# EAGLE design MidiIO (EAGLE 6.5.0)
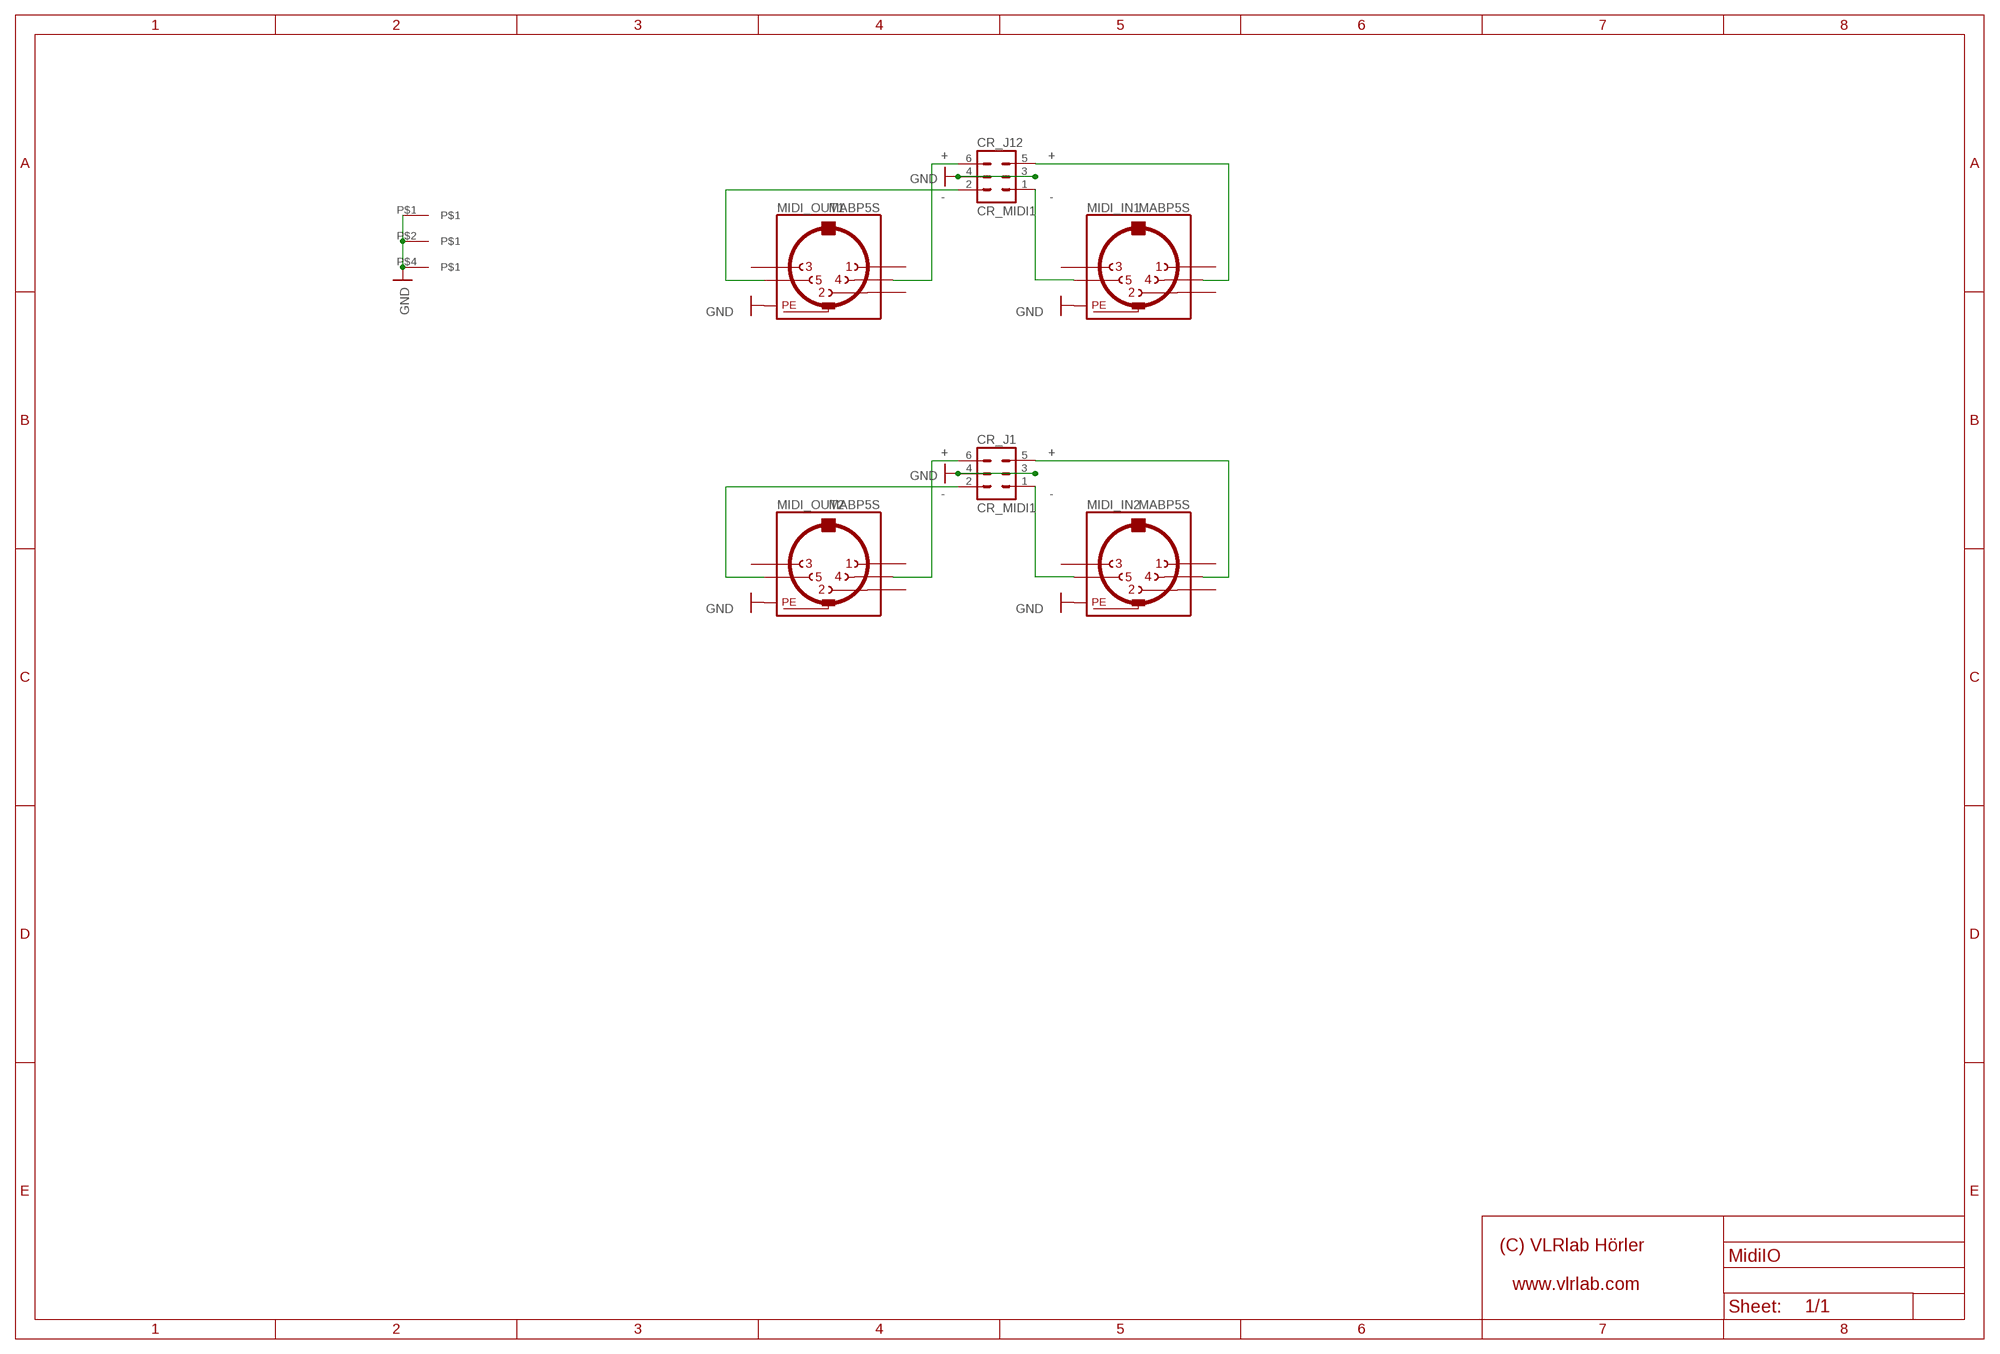
[diagram p0: schematic, sheet 1]

## Parts
CR_J1  CR_MIDI1  ML6  [ML6]
CR_J12  CR_MIDI1  ML6  [ML6]
MIDI_IN1  MABP5S  [MABP5S]
MIDI_IN2  MABP5S  [MABP5S]
MIDI_OUT1  MABP5S  [MABP5S]
MIDI_OUT2  MABP5S  [MABP5S]
U$2  MIDIBOX_HALF_FRONTLINE  [MIDIBOX14X6-FRONTLINE]

## Nets
CR_M1+: CR_J12.5 MIDI_IN1.4
CR_M1+1: CR_J1.5 MIDI_IN2.4
CR_M1-: CR_J12.1 MIDI_IN1.5
CR_M1-1: CR_J1.1 MIDI_IN2.5
GND: CR_J1.3 CR_J1.4 CR_J12.3 CR_J12.4 MIDI_IN1.PE MIDI_IN1.PE@(PE) MIDI_IN2.PE MIDI_IN2.PE@(PE) MIDI_OUT1.PE MIDI_OUT1.PE@(PE) MIDI_OUT2.PE MIDI_OUT2.PE@(PE) U$2.P$1 U$2.P$2 U$2.P$4
N$2: CR_J1.6 MIDI_OUT2.4
N$3: CR_J1.2 MIDI_OUT2.5
N$5: CR_J12.6 MIDI_OUT1.4
N$81: CR_J12.2 MIDI_OUT1.5
Unconnected: MIDI_IN1.1 MIDI_IN1.2 MIDI_IN1.3 MIDI_IN2.1 MIDI_IN2.2 MIDI_IN2.3 MIDI_OUT1.1 MIDI_OUT1.2 MIDI_OUT1.3 MIDI_OUT2.1 MIDI_OUT2.2 MIDI_OUT2.3

## Notes on the sheet
- + | +
- - | -
- + | +
- - | -

## Library data of the parts
CR_J1 CR_J12 = con-harting-ml:ML6: HARTING; OC_FARNELL: unknown; OC_NEWARK: unknown
MIDI_IN1 MIDI_IN2 MIDI_OUT1 MIDI_OUT2 = midi:MABP5S
U$2 = Frames_VLR:MIDIBOX_HALF_FRONTLINE

## Net classes
0 default: width 0.254 mm, drill 0.33 mm, clearance 0.254 mm
1 VDD: width 1.016 mm, drill 0.33 mm, clearance 0.254 mm to class 0, clearance 0.254 mm
3 SDcard: width 0.406 mm

## Board
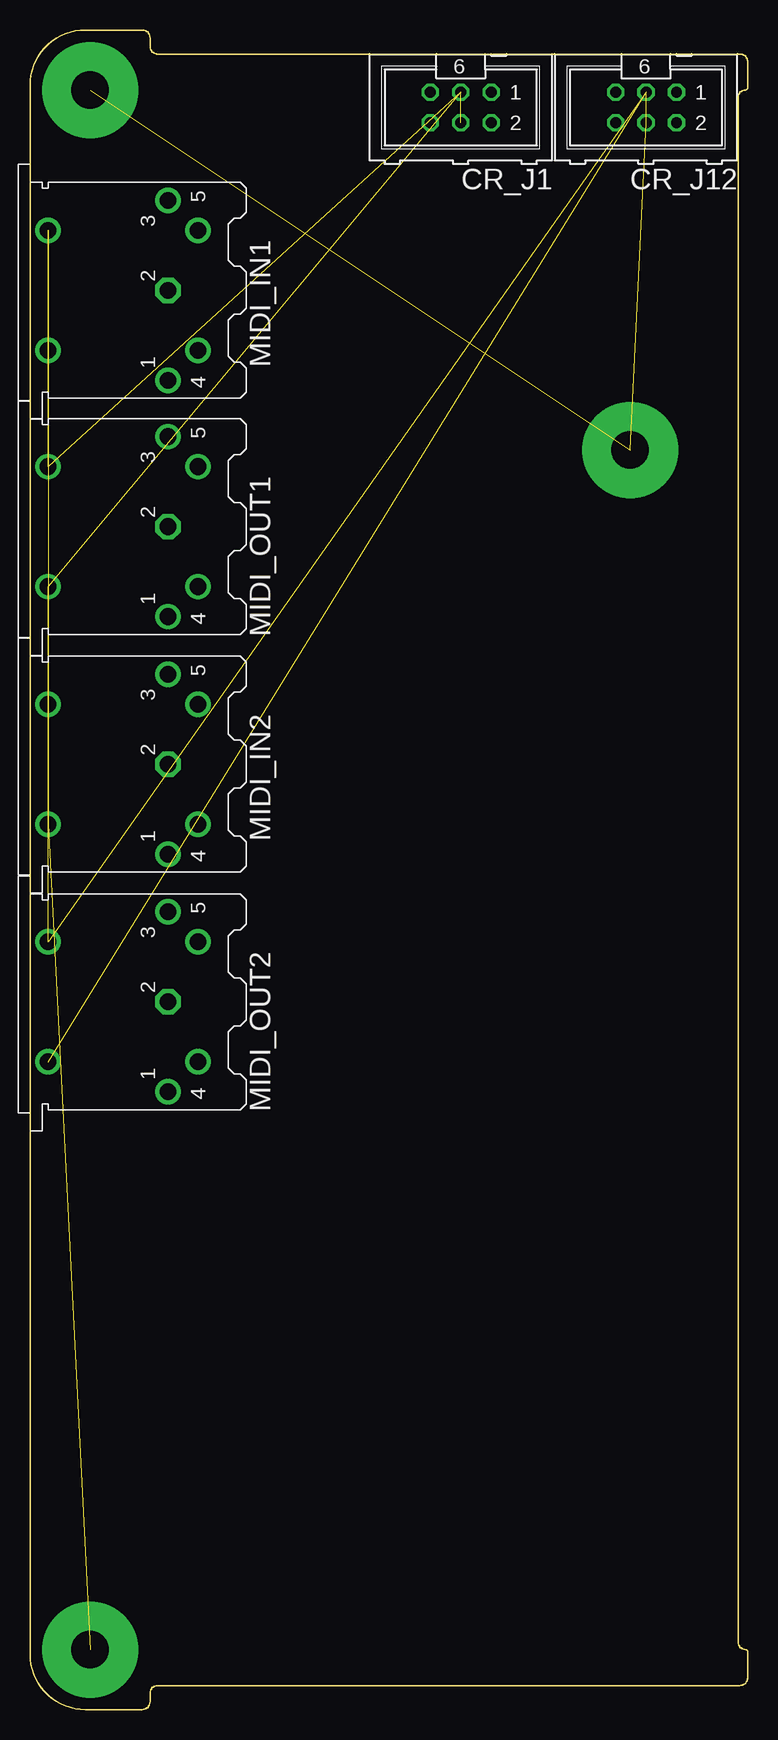
[diagram p1: board, top side]
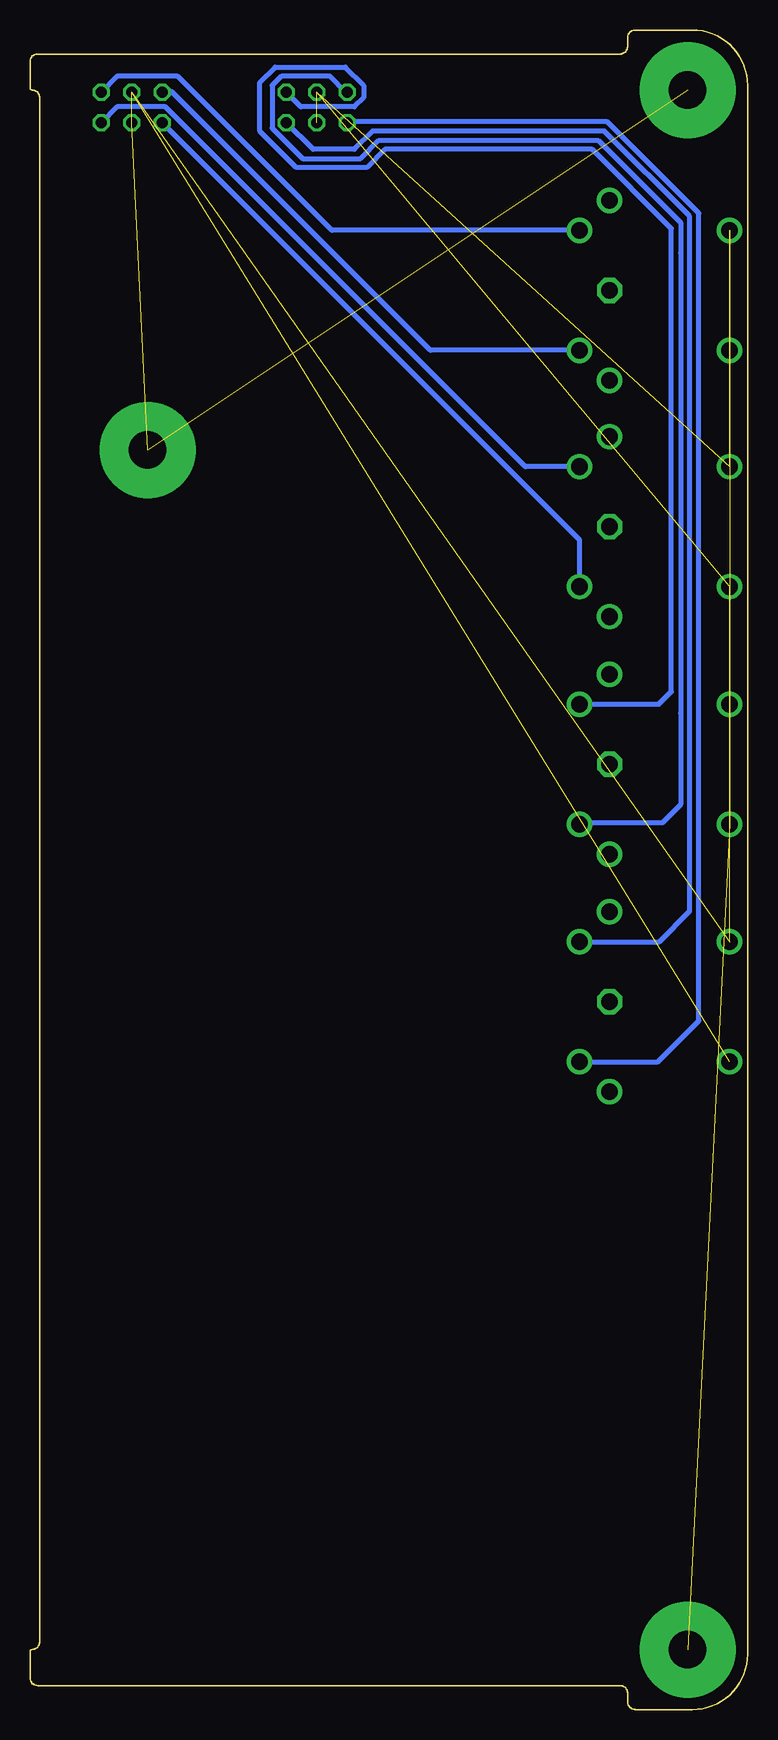
[diagram p2: board, bottom side, seen from below]

Size 59.8 x 140 mm. Coordinates in mm from the lower left corner, seen from the top.
Copper layers (1*16): Top 0.035mm / dielectric 1.5mm / Bottom 0.035mm
Design rules "default": minimum track width 10mil, minimum drill 24mil, track to track 8mil, track to pad 8mil, pad to pad 8mil, via to via 8mil, smd to smd 8mil, copper to edge 40mil, drill to drill 8mil, minimum pad ring 10mil, minimum via ring 8mil, stop-mask expansion 4mil, vias tented up to drill 0mil, thermal gap 10mil

### Footprints (pad centres in the part's own frame; a part is rotated, then mirrored left to right if it is on the bottom)
ML6 = drill 0.914 octagon: 1 -2.54,-1.27; 2 -2.54,1.27; 3 0,-1.27; 4 0,1.27; 5 2.54,-1.27; 6 2.54,1.27
MABP5S = drill 1.4: 1 -7.5,0; 3 7.5,0; 4 -5,-2.5; 5 5,-2.5; PE 5,10; PE@ -5,10 | drill 1.4 octagon: 2 0,0
MIDIBOX14X6-FRONTLINE = drill 3.1 pad 8: P$1 5,135; P$2 50,105; P$4 5,5

### Placement (x,y rotation side)
CR_J1  35.9,133.55 180 top
CR_J12  51.34,133.55 180 top
MIDI_IN1  11.5,118.3 90 top
MIDI_IN2  11.5,78.8 90 top
MIDI_OUT1  11.5,98.6 90 top
MIDI_OUT2  11.5,59 90 top
U$2  0,0 0 top

### Tracks (layer width: path | path; a pad name or v marks a point on that pad's centre or on a via)
CR_M1+
  Bottom 0.406: MIDI_IN1.4 26.43,113.3 47.5,134.37 48.01,134.87 48.74,134.87 CR_J12.5
CR_M1+1
  Bottom 0.406: CR_J1.5 33.47,134.82 34.8,136.14 38.86,136.14 39.62,135.38 39.62,131.83 39.37,131.57 37.08,129.29 32.26,129.29 30.73,130.81 28.45,130.81 12.45,130.81 5.59,123.95 5.59,121.41 5.59,83.06 5.59,75.44 7.11,73.91 13.89,73.91 MIDI_IN2.4
CR_M1-
  Bottom 0.406: MIDI_IN1.5 34.65,123.3 47.5,136.14 52.55,136.14 CR_J12.1
CR_M1-1
  Bottom 0.406: MIDI_IN2.5 7.39,83.8 6.35,84.84 6.35,123.44 12.95,130.05 30.23,130.05 31.75,128.52 37.59,128.52 40.64,131.57 40.64,135.64 39.37,136.91 33.53,136.91 32,135.38 32,134.37 32.77,133.6 37.22,133.6 CR_J1.1
GND  (14 unrouted)
N$2
  Bottom 0.406: MIDI_OUT2.4 7.47,54 4.06,57.4 4.06,124.71 11.68,132.33 33.3,132.33 CR_J1.6
N$3
  Bottom 0.406: MIDI_OUT2.5 7.37,64 4.83,66.55 4.83,124.46 11.94,131.57 31.24,131.57 32.77,130.05 36.2,130.05 CR_J1.2
N$5
  Bottom 0.406: MIDI_OUT1.4 14,97.48 CR_J12.6
N$81
  Bottom 0.406: MIDI_OUT1.5 18.51,103.6 48.26,133.35 48.51,133.6 52.55,133.6 CR_J12.2